# EasyEDA schematic 8086MemoryInterfacing.json

## Sheets
1 2764/6116RAM: TITLE: Sheet_1; REV: 1.0; Date: 2020-08-07; Sheet: 1/1; Company: Finalartproduct
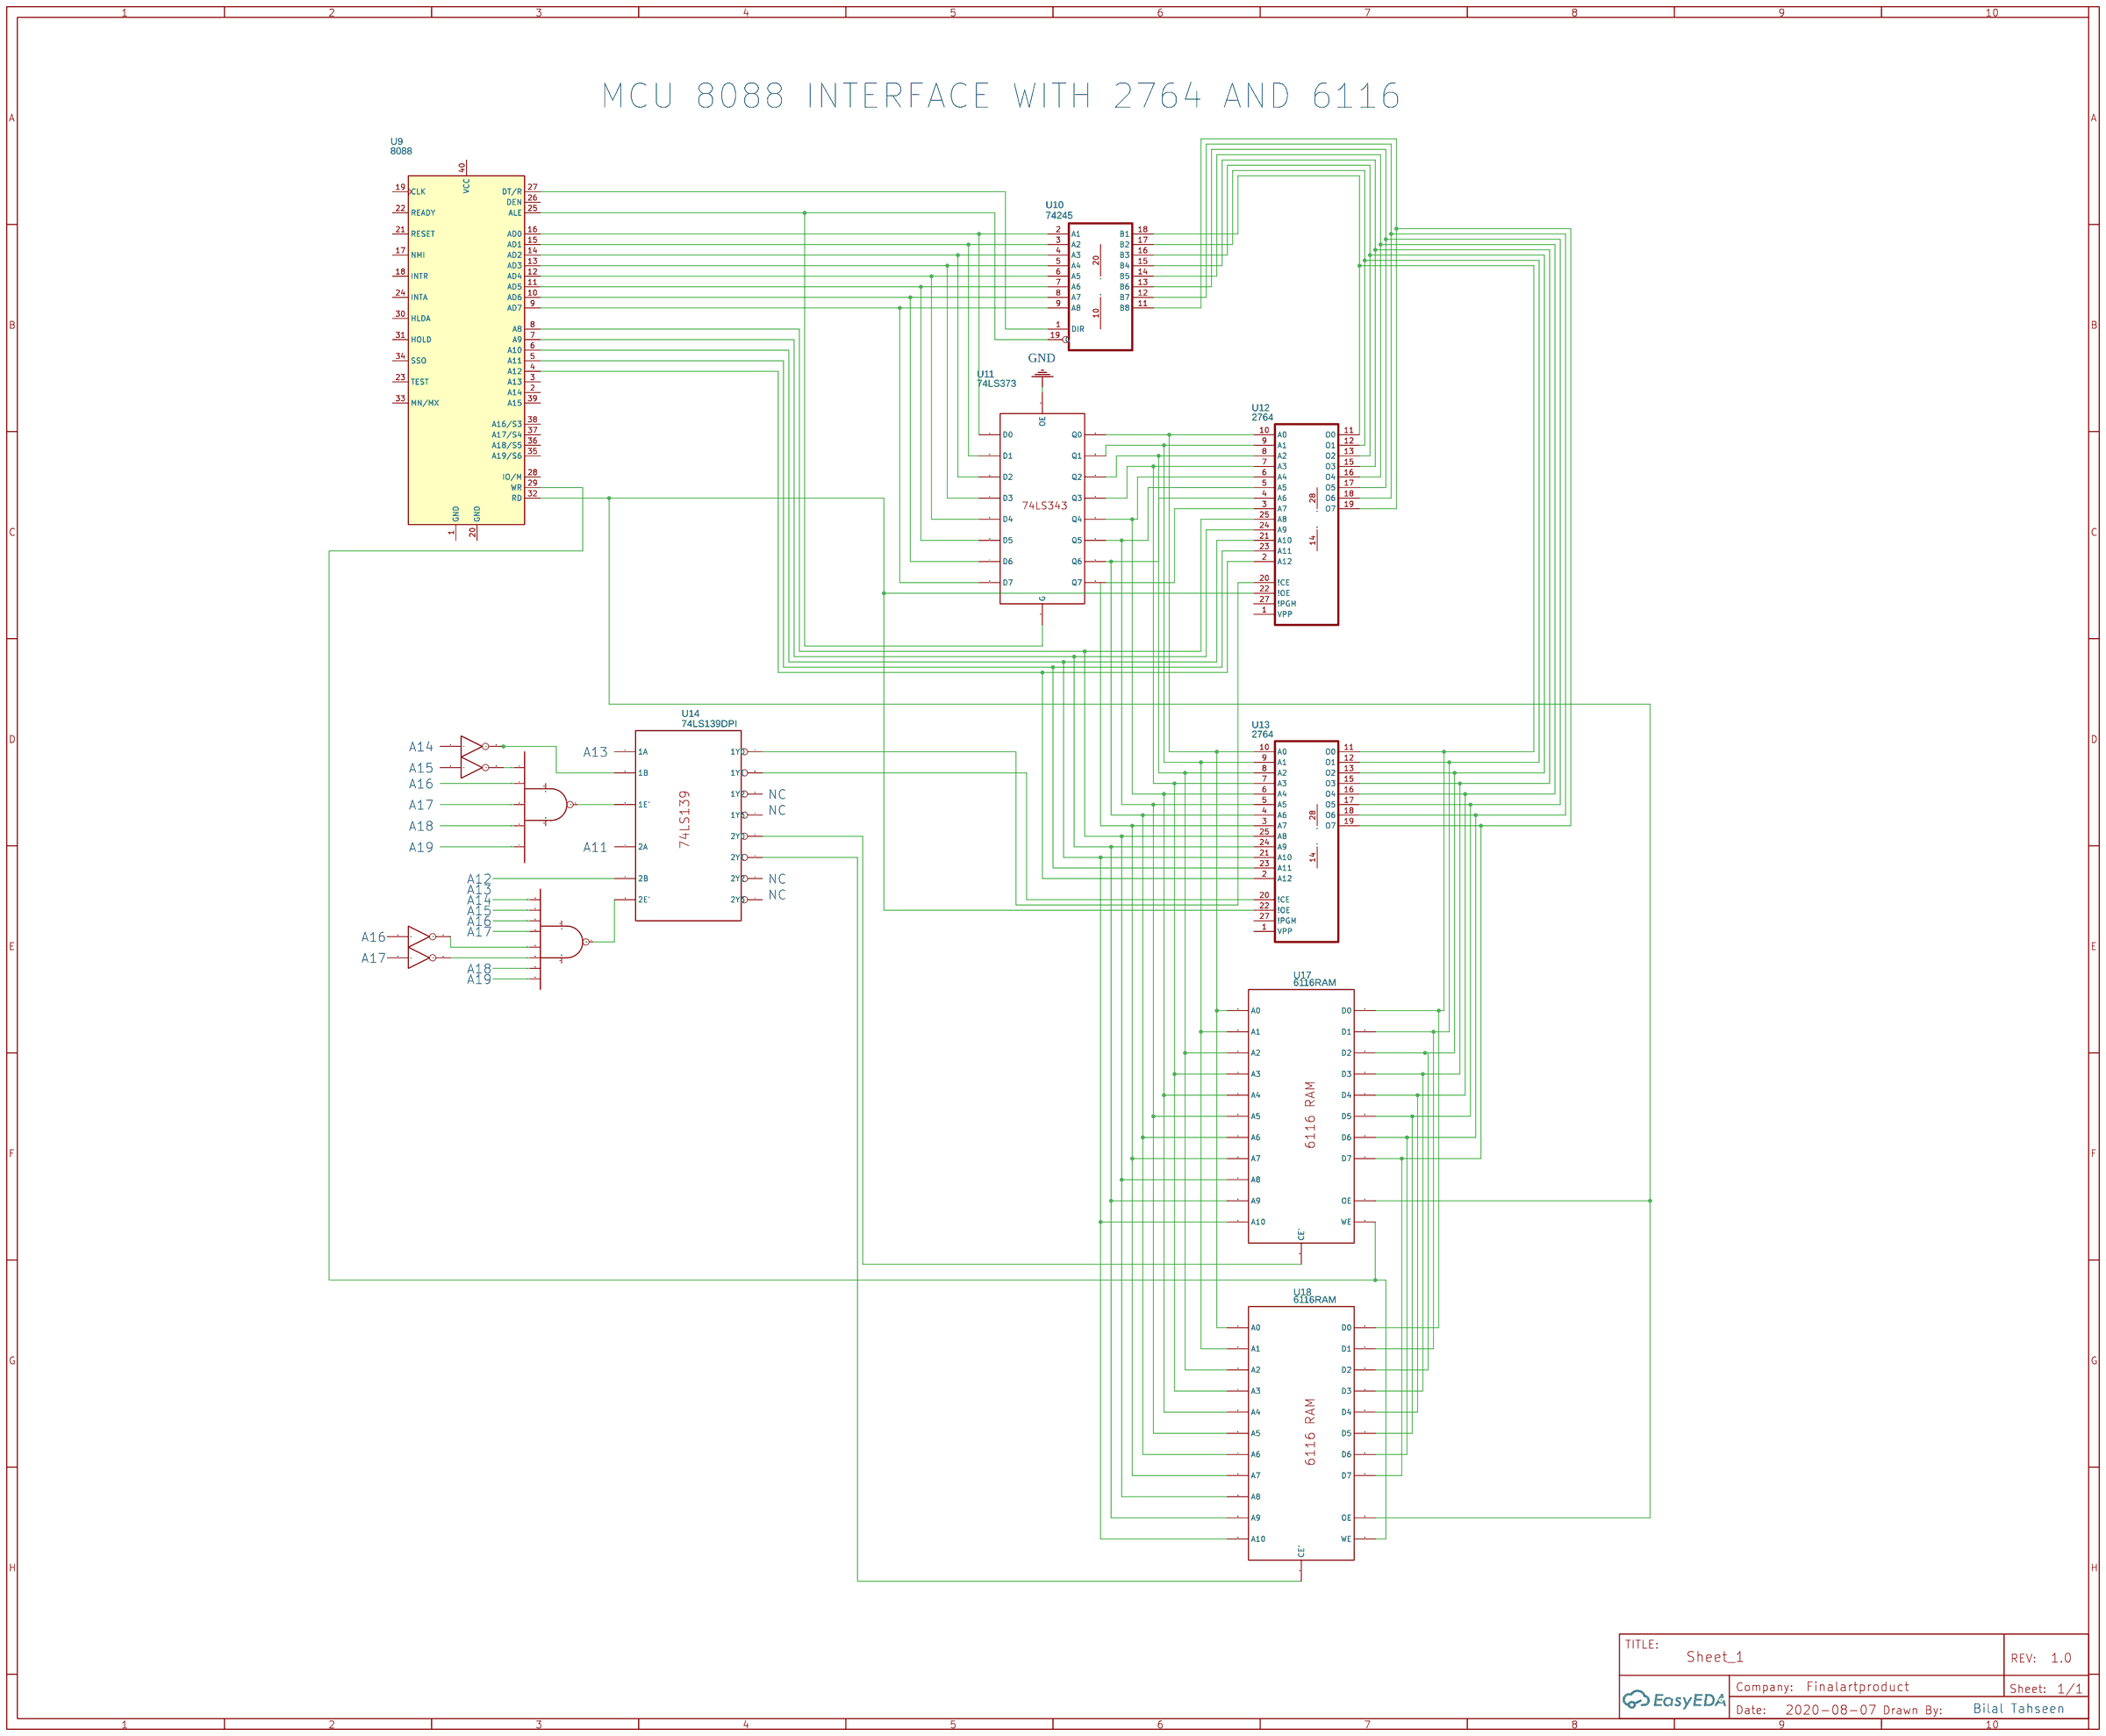
[diagram p0: 2764/6116RAM]
2 8245/8255PIT/C
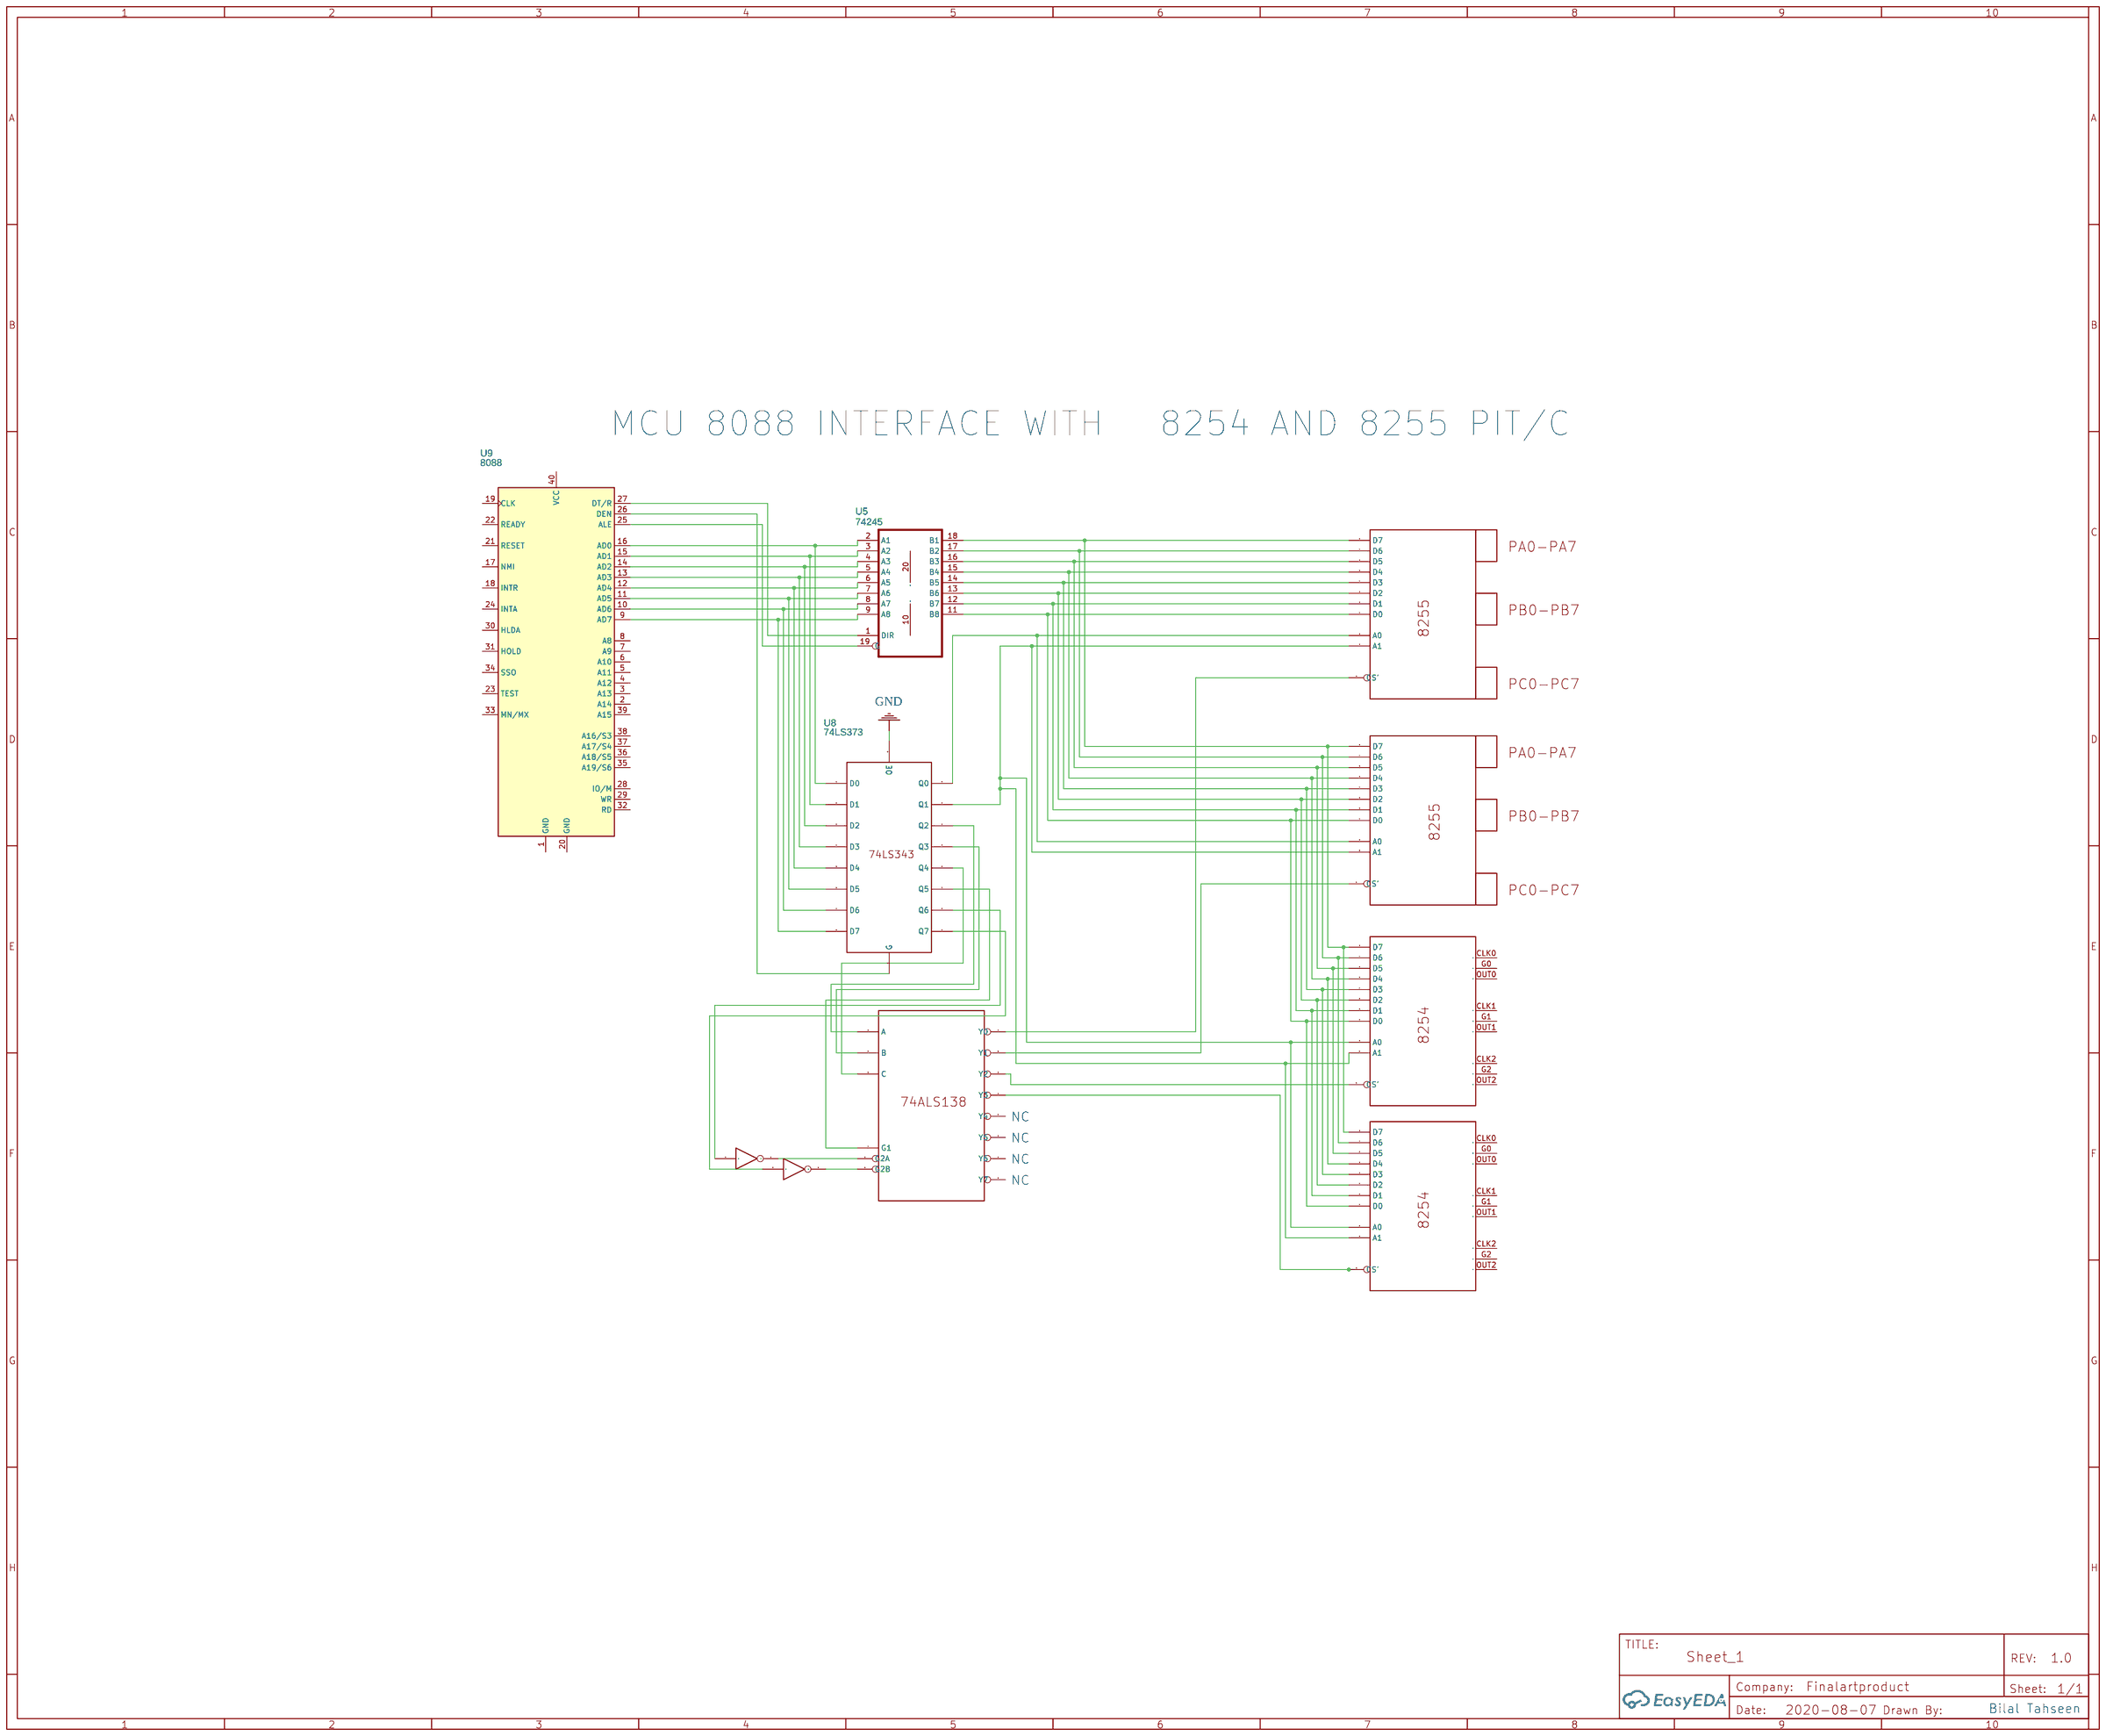
[diagram p1: 8245/8255PIT/C]

## Parts
sheet 2764/6116RAM
U1  8_NAND
U2  InvertorSmall
U3  InvertorSmall
U4  InvertorSmall
U9  8088  [DIP-40_W15.24MM]
U10  74245  [SSOP20]
U11  74LS373
U12  2764
U13  2764
U14  74LS139DPI
U15  5_NAND
U17  6116RAM
U18  6116RAM
U23  InvertorSmall
sheet 8245/8255PIT/C
U5  74245  [SSOP20]
U6  8255
U7  8255
U8  74LS373
U9#2  8088  [DIP-40_W15.24MM]
U16  74ALS138DIP
U19  8254
U20  8254
U21  InvertorSmall
U22  InvertorSmall

## Library data of the parts
U1-U4 U15 U21-U23 = LOGIC: Contributor: Bilal Khan; sim: true
U9 U9#2 = 8088: Contributor: KiCAD; license: https://www.gnu.org/licenses/lgpl-2.1.html
U5 U10 = 74245: Contributor: Adafruit
U8 U11 = 74LS373: Contributor: Bilal Khan
U12 U13 = 2764
U14 = 74LS139DPI: Contributor: Bilal Khan
U17 U18 = 6116RAM: Contributor: Bilal Khan
U6 U7 = 8255: Contributor: bilaltehseen
U16 = 74ALS138DIP: Contributor: Bilal Khan
U19 U20 = 8254: Contributor: Bilal Khan

## Nets
GND: U8.OE U11.OE
Net-(U1-3): U1.3(INC) U2.8(1) U23.8(1)
Net-(U1-7): U1.7(OUT) U14.6(2E')
Net-(U3-8): U3.8(1) U15.1(INA)
Net-(U4-8): U4.8(1) U14.2(1B)
Net-(U5-1): U5.1(DIR) U9#2.27(DT/R)
Net-(U5-2): U5.2(A1) U8.1(D0) U9#2.16(AD0)
Net-(U5-3): U5.3(A2) U8.2(D1) U9#2.15(AD1)
Net-(U5-4): U5.4(A3) U8.3(D2) U9#2.14(AD2)
Net-(U5-5): U5.5(A4) U8.4(D3) U9#2.13(AD3)
Net-(U5-6): U5.6(A5) U8.5(D4) U9#2.12(AD4)
Net-(U5-7): U5.7(A6) U8.6(D5) U9#2.11(AD5)
Net-(U5-8): U5.8(A7) U8.7(D6) U9#2.10(AD6)
Net-(U5-9): U5.9(A8) U8.8(D7) U9#2.9(AD7)
Net-(U5-11): U5.11(B8) U6.1(D0) U7.1(D0) U19.1(D0) U20.1(D0)
Net-(U5-12): U5.12(B7) U6.2(D1) U7.2(D1) U19.2(D1) U20.2(D1)
Net-(U5-13): U5.13(B6) U6.3(D2) U7.3(D2) U19.3(D2) U20.3(D2)
Net-(U5-14): U5.14(B5) U6.4(D3) U7.4(D3) U19.4(D3) U20.4(D3)
Net-(U5-15): U5.15(B4) U6.5(D4) U7.5(D4) U19.5(D4) U20.5(D4)
Net-(U5-16): U5.16(B3) U6.6(D5) U7.6(D5) U19.6(D5) U20.6(D5)
Net-(U5-17): U5.17(B2) U6.7(D6) U7.7(D6) U19.7(D6) U20.7(D6)
Net-(U5-18): U5.18(B1) U6.8(D7) U7.8(D7) U19.8(D7) U20.8(D7)
Net-(U5-19): U5.19(G) U9#2.25(ALE)
Net-(U6-9): U6.9(A0) U7.9(A0) U8.9(Q0)
Net-(U6-10): U6.10(A1) U7.10(A1) U8.10(Q1) U19.9(A0) U19.10(A1) U20.9(A0) U20.10(A1)
Net-(U6-11): U6.11(CS') U16.7(Y0)
Net-(U7-11): U7.11(CS') U16.19(Y1)
Net-(U8-11): U8.11(Q2) U16.1(A)
Net-(U8-12): U8.12(Q3) U16.2(B)
Net-(U8-13): U8.13(Q4) U16.3(C)
Net-(U8-14): U8.14(Q5) U16.4(G1)
Net-(U8-15): U8.15(Q6) U22.9(2)
Net-(U8-16): U8.16(Q7) U21.9(2)
Net-(U8-18): U8.18(G) U9#2.26(DEN)
Net-(U9-4): U9.4(A12) U12.2(A12) U13.2(A12)
Net-(U9-5): U9.5(A11) U12.23(A11) U13.23(A11)
Net-(U9-6): U9.6(A10) U9.7(A9) U12.21(A10) U12.24(A9) U13.21(A10) U13.24(A9) U17.10(A10) U18.10(A10)
Net-(U9-8): U9.8(A8) U12.25(A8) U13.25(A8) U17.9(A8) U18.9(A8)
Net-(U9-9): U9.9(AD7) U10.9(A8) U11.8(D7)
Net-(U9-10): U9.10(AD6) U10.8(A7) U11.7(D6)
Net-(U9-11): U9.11(AD5) U10.7(A6) U11.6(D5)
Net-(U9-12): U9.12(AD4) U10.6(A5) U11.5(D4)
Net-(U9-13): U9.13(AD3) U10.5(A4) U11.4(D3)
Net-(U9-14): U9.14(AD2) U10.4(A3) U11.3(D2)
Net-(U9-15): U9.15(AD1) U10.3(A2) U11.2(D1)
Net-(U9-16): U9.16(AD0) U10.2(A1) U11.1(D0)
Net-(U9-25): U9.25(ALE) U10.19(G) U11.18(G)
Net-(U9-27): U9.27(DT/R) U10.1(DIR)
Net-(U9-29): U9.29(WR) U17.25(WE) U18.25(WE)
Net-(U9-32): U9.32(RD) U12.22(!OE) U13.22(!OE) U17.24(OE) U18.24(OE)
Net-(U10-11): U10.11(B8) U12.19(O7) U13.19(O7) U17.23(D7) U18.23(D7)
Net-(U10-12): U10.12(B7) U12.18(O6) U13.18(O6) U17.22(D6) U18.22(D6)
Net-(U10-13): U10.13(B6) U12.17(O5) U13.17(O5) U17.21(D5) U18.21(D5)
Net-(U10-14): U10.14(B5) U12.16(O4) U13.16(O4) U17.20(D4) U18.20(D4)
Net-(U10-15): U10.15(B4) U12.15(O3) U13.15(O3) U17.19(D3) U18.19(D3)
Net-(U10-16): U10.16(B3) U12.13(O2) U13.13(O2) U17.13(D2) U18.13(D2)
Net-(U10-17): U10.17(B2) U12.12(O1) U13.12(O1) U17.12(D1) U18.12(D1)
Net-(U10-18): U10.18(B1) U12.11(O0) U13.11(O0) U17.11(D0) U18.11(D0)
Net-(U11-9): U11.9(Q0) U12.10(A0) U13.10(A0) U17.1(A0) U18.1(A0)
Net-(U11-10): U11.10(Q1) U12.9(A1) U13.9(A1) U17.2(A1) U18.2(A1)
Net-(U11-11): U11.11(Q2) U12.8(A2) U13.8(A2) U17.3(A2) U18.3(A2)
Net-(U11-12): U11.12(Q3) U12.7(A3) U13.7(A3) U17.4(A3) U18.4(A3)
Net-(U11-13): U11.13(Q4) U12.6(A4) U13.6(A4) U17.5(A4) U18.5(A4)
Net-(U11-14): U11.14(Q5) U12.5(A5) U13.5(A5) U17.6(A5) U18.6(A5)
Net-(U11-15): U11.15(Q6) U12.4(A6) U13.4(A6) U17.7(A6) U18.7(A6)
Net-(U11-16): U11.16(Q7) U12.3(A7)
Net-(U12-20): U12.20(!CE) U14.7(1Y0)
Net-(U13-3): U13.3(A7) U17.8(A7) U18.8(A7)
Net-(U13-20): U13.20(!CE) U14.8(1Y1)
Net-(U14-1): U14.1(2Y3) U17.26(CE') U18.26(CE')
Net-(U14-3): U14.3(1E') U15.7(OUT)
Net-(U16-5): U16.5(G2A) U22.8(1)
Net-(U16-6): U16.6(G2B) U21.8(1)
Net-(U16-20): U16.20(Y2) U19.11(CS')
Net-(U16-21): U16.21(Y3) U20.11(CS')

Not connected (* = marked no-connect by the designer): U1 5(VDD) 6(GND); U2 9(2); U3 9(2); U4 9(2); U5 10(GND) 20(VCC); U9 1(GND) 2(A14) 3(A13) 17(NMI) 18(INTR) 19(CLK) 20(GND) 21(RESET) 22(READY) 23(TEST) 24(INTA) 26(DEN) 28(IO/M) 30(HLDA) 31(HOLD) 33(MN/MX) 34(SSO) 35(A19/S6) 36(A18/S5) 37(A17/S4) 38(A16/S3) 39(A15) 40(VCC); U9#2 1(GND) 2(A14) 3(A13) 4(A12) 5(A11) 6(A10) 7(A9) 8(A8) 17(NMI) 18(INTR) 19(CLK) 20(GND) 21(RESET) 22(READY) 23(TEST) 24(INTA) 28(IO/M) 29(WR) 30(HLDA) 31(HOLD) 32(RD) 33(MN/MX) 34(SSO) 35(A19/S6) 36(A18/S5) 37(A17/S4) 38(A16/S3) 39(A15) 40(VCC); U10 10(GND) 20(VCC); U12 1(VPP) 14(GND) 27(!PGM) 28(VCC); U13 1(VPP) 14(GND) 27(!PGM) 28(VCC); U14 4(2A) 5(2B) 9(1Y2); U15 2(INB) 3(INC) 4(IND) 5(VDD) 6(GND); U16 22(Y4) 23(Y5) 24(Y6) 25(Y7); U19 CLK0(8) CLK1(8) CLK2(8) G0(9) G1(9) G2(9) OUT0(10) OUT1(10) OUT2(10); U20 CLK0(8) CLK1(8) CLK2(8) G0(9) G1(9) G2(9) OUT0(10) OUT1(10) OUT2(10); U23 9(2)

## Notes on the sheets
sheet 1
- MCU 8088 INTERFACE WITH 2764 AND 6116
- A14
- A13
- A15
- A16
- NC
- A17
- NC
- A18
- A19
- A11
- A12
- A13
- NC
- A14
- NC
- A15
- A16
- A16
- A17
- A17
- A18
- A19
- Bilal Tahseen
sheet 2
- MCU 8088 INTERFACE WITH   8254 AND 8255 PIT/C
- NC
- NC
- NC
- NC
- Bilal Tahseen
